# Altium project PowerBoard.PrjPcb
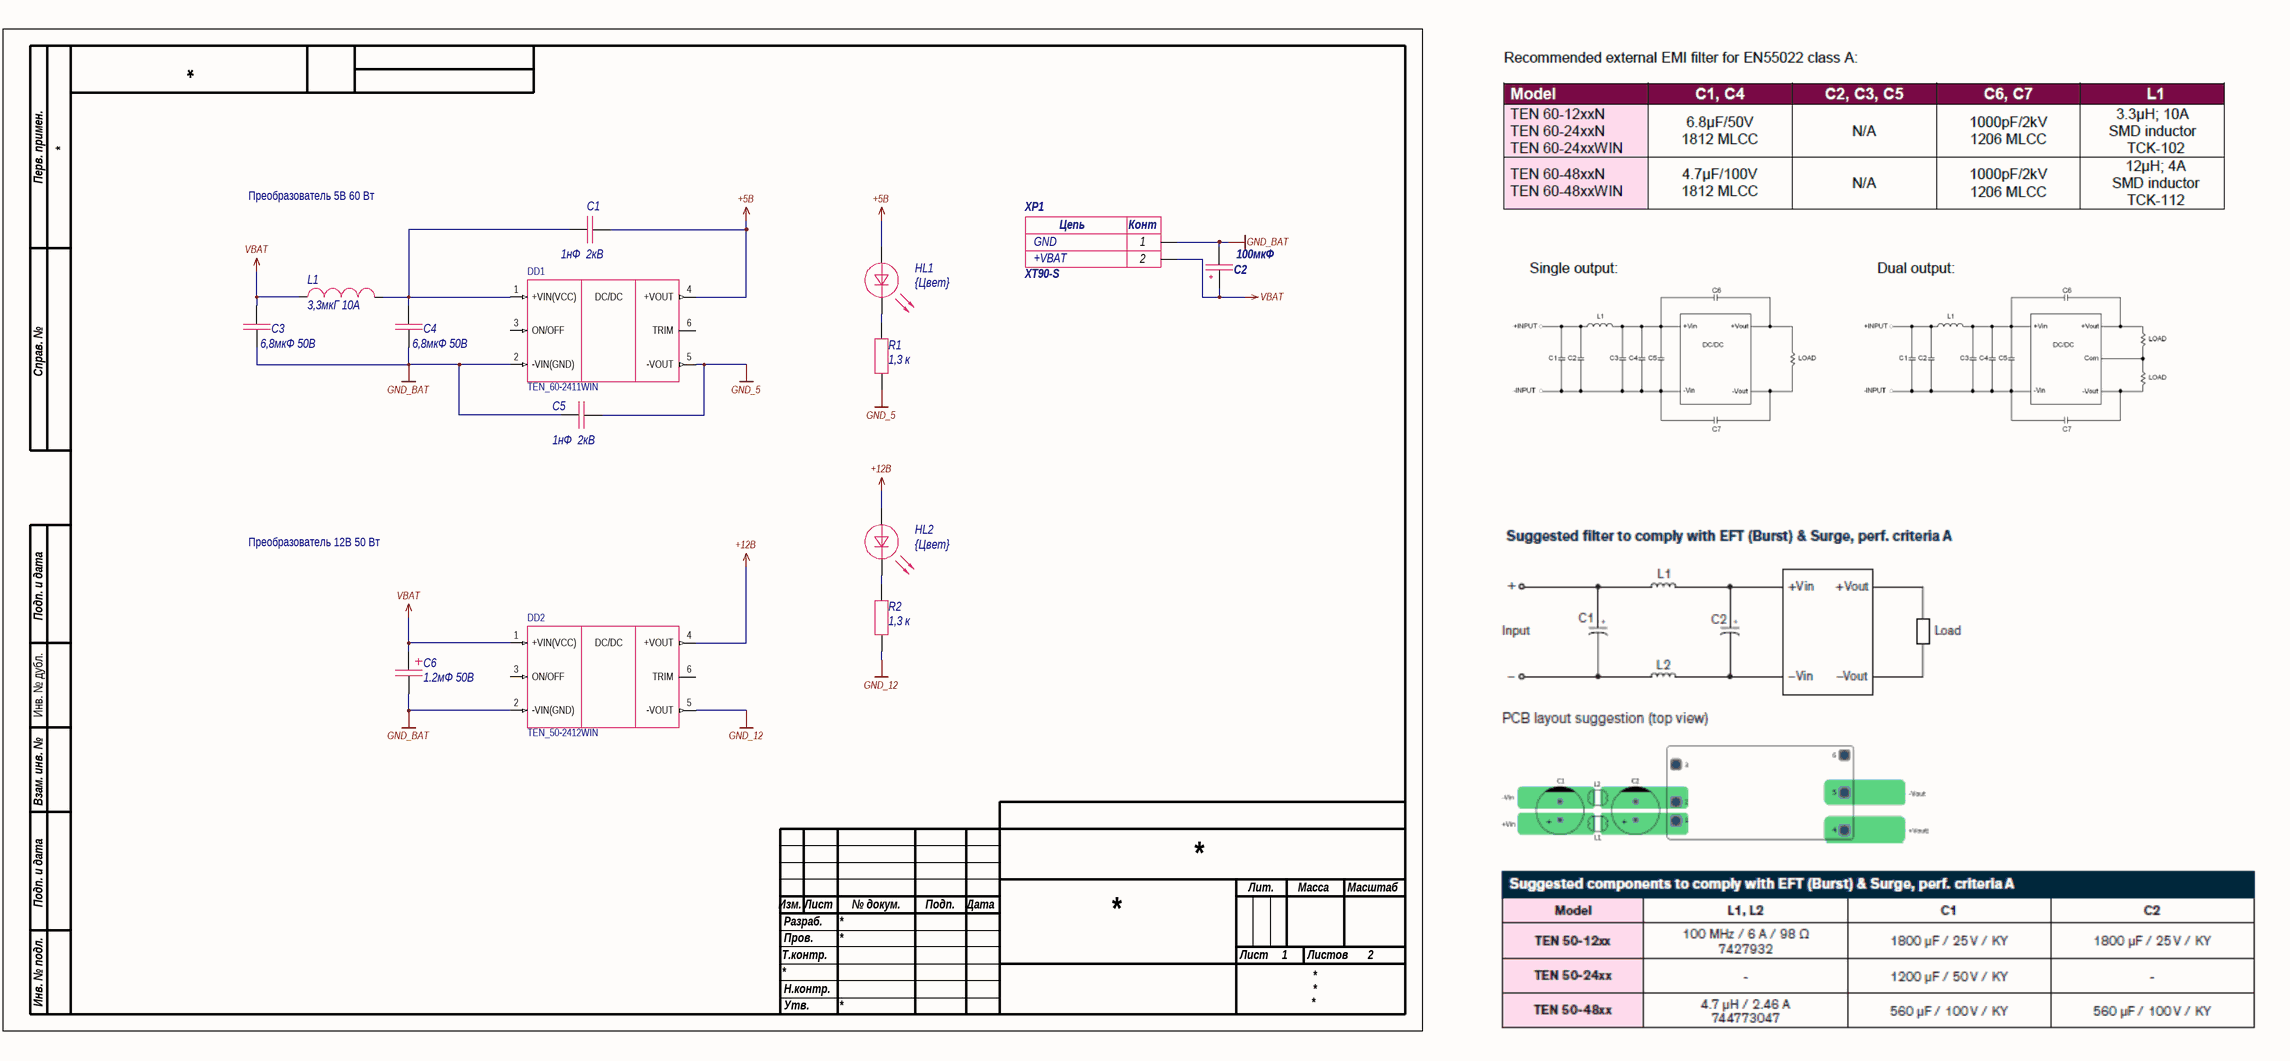
[diagram p0: dcdc.SchDoc]
2 sheets, 16 parts. Net scope: global (net labels, ports and power ports of the same name join across sheets).
Board file: PCB2.PcbDoc
Sheets:
  dcdc.SchDoc
  connectors.SchDoc

## Sheet dcdc.SchDoc
size 420 x 297 mm; SheetNumber: 1; SheetTotal: 2

### Parts
C1  value 1нФ  2кВ  [1206]  (hidden comment: Capacitor)
C2  value 100мкФ  [CAPPR65-350-1150X800X1250]  (hidden comment: 100uF)
C3  value 6,8мкФ 50В  [1812]  (hidden comment: Capacitor)
C4  value 6,8мкФ 50В  [1812]  (hidden comment: Capacitor)
C5  value 1нФ  2кВ  [1206]  (hidden comment: Capacitor)
C6  value 1.2мФ 50В  [THD12.5.25]  (hidden comment: 1uF)
DD1  TEN_60-2411WIN  value DC/DC  [CONV_TEN_60-2411WIN]
DD2  TEN_50-2412WIN  value DC/DC  [CONV_TEN_60-2411WIN]
HL1  Color: {Цвет}  [0805D]
HL2  Color: {Цвет}  [0805D]
L1  value 3,3мкГ 10А  [TCK-102]  (hidden comment: Inductance)
R1  value 1,3 к  [0603R]  (hidden comment: Resistor)
R2  value 1,3 к  [0603R]  (hidden comment: Resistor)
XP1  value XT90-S  Value1: GND  Value2: +VBAT  [AMASS_XT90-M]  (hidden comment: XT-90)

### Nets
+5В: C1.1 DD1.4(+VOUT) HL1.1
+12В: DD2.4(+VOUT) HL2.1
GND_5: C5.1 DD1.5(-VOUT) R1.1
GND_12: DD2.5(-VOUT) R2.1
GND_BAT: C2.2 C3.1 C4.1 C5.2 C6.2 DD1.2(-VIN(GND)) DD2.2(-VIN(GND)) XP1.1
VBAT: C2.1 C3.2 C6.1 DD2.1(+VIN(VCC)) L1.1 XP1.2
NetC1_2: C1.2 C4.2 DD1.1(+VIN(VCC)) L1.2
NetHL1_2: HL1.2 R1.2
NetHL2_2: HL2.2 R2.2

Not connected (* = marked no-connect by the designer): DD1 3(ON/OFF) 6(TRIM); DD2 3(ON/OFF) 6(TRIM)

### Notes on the sheet
- Преобразователь 5В 60 Вт
- Преобразователь 12В 50 Вт
- Перв. примен.
- Справ. №
- Подп. и дата
- Инв. № дубл.
- Взам. инв. №
- Изм.
- Лист
- № докум.
- Подп.
- Дата
- Лит.
- Масса
- Масштаб
- Т.контр.
- Пров.
- Разраб.
- Листов
- Инв. № подл.
- Н.контр.
- Утв.
- (in symbol XT-90) Цепь; Конт

### Library data of the parts
C2 = Capacitor_pol_100uF: Shop: https://www.chipdip.ru/product0/9000565887
C6 = Capacitor_pol: Shop: https://www.chipdip.ru/product0/8003159251 https://www.promelec.ru/product/379547/
DD2 = TEN_60-2411WIN: Price: None; MP: TEN_60-2411WIN; Package: None; Availability: Unavailable
HL1 HL2 = LED: Manufacturer: -; Rate: -; Datasheet: -; Shop: -; Notice: -; Case: -
XP1 = XT-90: Manufacturer: Connfly; Notice: Вилка-мама 2 пина, шаг 2.5мм; Rate: 500В AC 1min; Case: корпус; Datasheet: https://lib.chipdip.ru/413/DOC001413777.pdf; Shop: https://www.chipdip.ru/product/cwf-2
DD1 = TEN_60-2411WIN: Price: None; MP: TEN_60-2411WIN; Package: None; Availability: Unavailable
L1 = Inductance: Shop: https://www.chipdip.ru/product1/8009327451

## Sheet connectors.SchDoc
size 297 x 420 mm; SheetNumber: 2; SheetTotal: 2
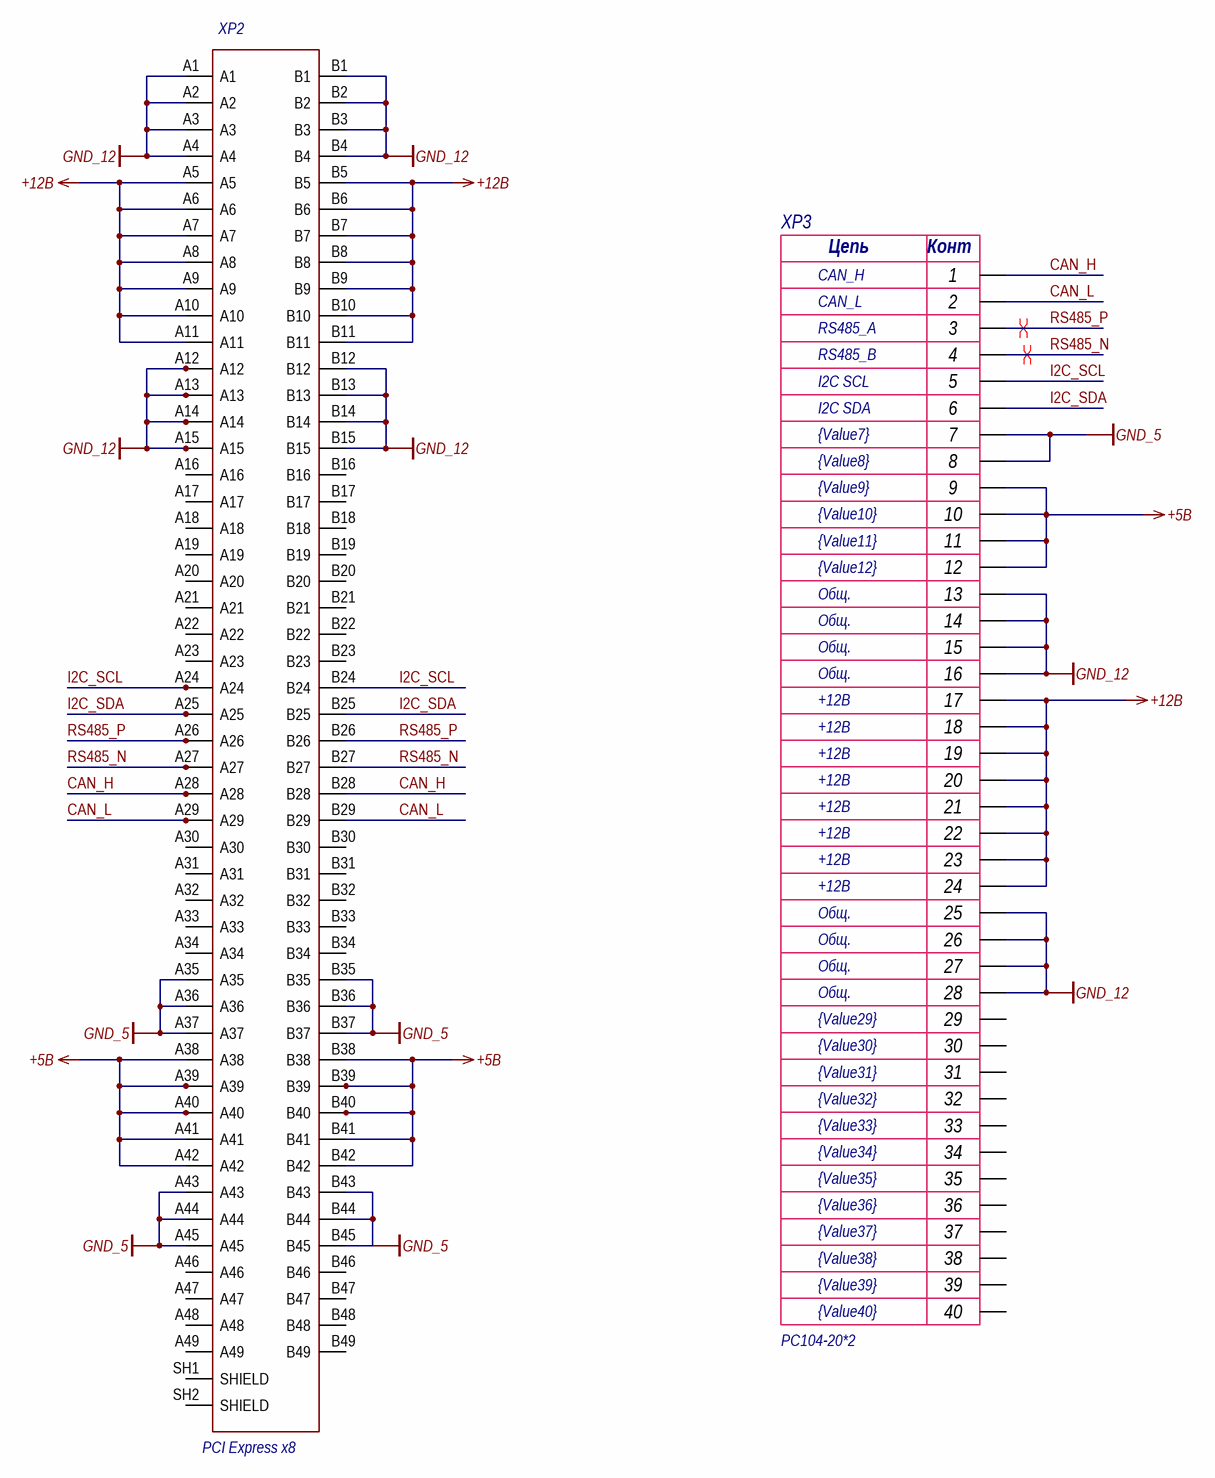
[diagram p1: connectors.SchDoc]

### Parts
XP2  PCI Express x8  [pci-e-x8]
XP3  Value10: {Value10}  Value11: {Value11}  Value12: {Value12}  Value13: Общ.  Value17: +12В  Value1: CAN_H  Value2: CAN_L  Value3: RS485_A  Value4: RS485_B  Value5: I2C SCL  Value6: I2C SDA  Value7: {Value7}  Value8: {Value8}  Value9: {Value9}  Value29: {Value29}  Value30: {Value30}  Value31: {Value31}  Value32: {Value32}  Value33: {Value33}  Value34: {Value34}  Value35: {Value35}  Value36: {Value36}  Value37: {Value37}  Value38: {Value38}  Value39: {Value39}  Value40: {Value40}  [PC - 104 20X2]  (hidden comment: PC104-20*2)

### Nets
+5В: XP2.A38 XP2.A39 XP2.A40 XP2.A41 XP2.A42 XP2.B38 XP2.B39 XP2.B40 XP2.B41 XP2.B42 XP3.9 XP3.10 XP3.11 XP3.12
+12В: XP2.A5 XP2.A6 XP2.A7 XP2.A8 XP2.A9 XP2.A10 XP2.A11 XP2.B5 XP2.B6 XP2.B7 XP2.B8 XP2.B9 XP2.B10 XP2.B11 XP3.17 XP3.18 XP3.19 XP3.20 XP3.21 XP3.22 XP3.23 XP3.24
GND_5: XP2.A35 XP2.A36 XP2.A37 XP2.A43 XP2.A44 XP2.A45 XP2.B35 XP2.B36 XP2.B37 XP2.B43 XP2.B44 XP2.B45 XP3.7 XP3.8
GND_12: XP2.A1 XP2.A2 XP2.A3 XP2.A4 XP2.A12 XP2.A13 XP2.A14 XP2.A15 XP2.B1 XP2.B2 XP2.B3 XP2.B4 XP2.B12 XP2.B13 XP2.B14 XP2.B15 XP3.13 XP3.14 XP3.15 XP3.16 XP3.25 XP3.26 XP3.27 XP3.28
CAN_H: XP2.A28 XP2.B28 XP3.1
CAN_L: XP2.A29 XP2.B29 XP3.2
I2C_SCL: XP2.A24 XP2.B24 XP3.5
I2C_SDA: XP2.A25 XP2.B25 XP3.6
RS485_N: XP2.A27 XP2.B27 XP3.4
RS485_P: XP2.A26 XP2.B26 XP3.3

Not connected (* = marked no-connect by the designer): XP2 A16 A17 A18 A19 A20 A21 A22 A23 A30 A31 A32 A33 A34 A46 A47 A48 A49 B16 B17 B18 B19 B20 B21 B22 B23 B30 B31 B32 B33 B34 B46 B47 B48 B49 SH1(SHIELD) SH2(SHIELD); XP3 29 30 31 32 33 34 35 36 37 38 39 40

### Layout directives
differential pair: RS485_N, RS485_P

### Notes on the sheet
- Подп. дата
- Инв. № дубл.
- Взам. инв. №
- Подп. и дата
- Инв. № подл.
- Изм.
- Лист
- № докум.
- Подп.
- Дата
- ALTIUM GOSTBOM2.0 KEV
- Файл:
- Копировал
- Формат А3
- (in symbol PC104-20*2) Цепь; Конт

### Library data of the parts
XP2 = PCI E x8: PCI ExpressÂ®x8 vertical Card Edge Connector, 98 Positions, 1mm (0.039inch) Pitch; MP: 10146070-112Y0LF; MF: Amphenol ICC (FCI); Package: None; SnapEDA_Link: https://www.snapeda.com/parts/10146070-112Y0LF/Amphenol+FCI/view-part/?ref=snap; Value: *; Availability: In Stock; Price: None; Purchase-URL: https://pricing.snapeda.com/search/part/10146070-112Y0LF/?ref=eda; Check_prices: https://www.snapeda.com/parts/10146070-112Y0LF/Amphenol+FCI/view-part/?ref=eda
XP3 = PC104-20*2: Notice: PC104-40; Value: PC104-20*2; Value14: Общ.; Value15: Общ.; Value16: Общ.; Value18: +12В; Value19: +12В; Value20: +12В; Value21: +12В; Value22: +12В; Value23: +12В; Value24: +12В; Value25: Общ.; Value26: Общ.; Value27: Общ.; Value28: Общ.

## Nets that join several sheets
+5В: dcdc (C1.1 DD1.4 HL1.1), connectors (14 pins)
+12В: dcdc (DD2.4 HL2.1), connectors (22 pins)
GND_5: dcdc (C5.1 DD1.5 R1.1), connectors (14 pins)
GND_12: dcdc (DD2.5 R2.1), connectors (24 pins)